# Altium project Carrier_Board.PrjPcb (part 2 of 2)

## Sheet [03] - GSM.SchDoc
size A2
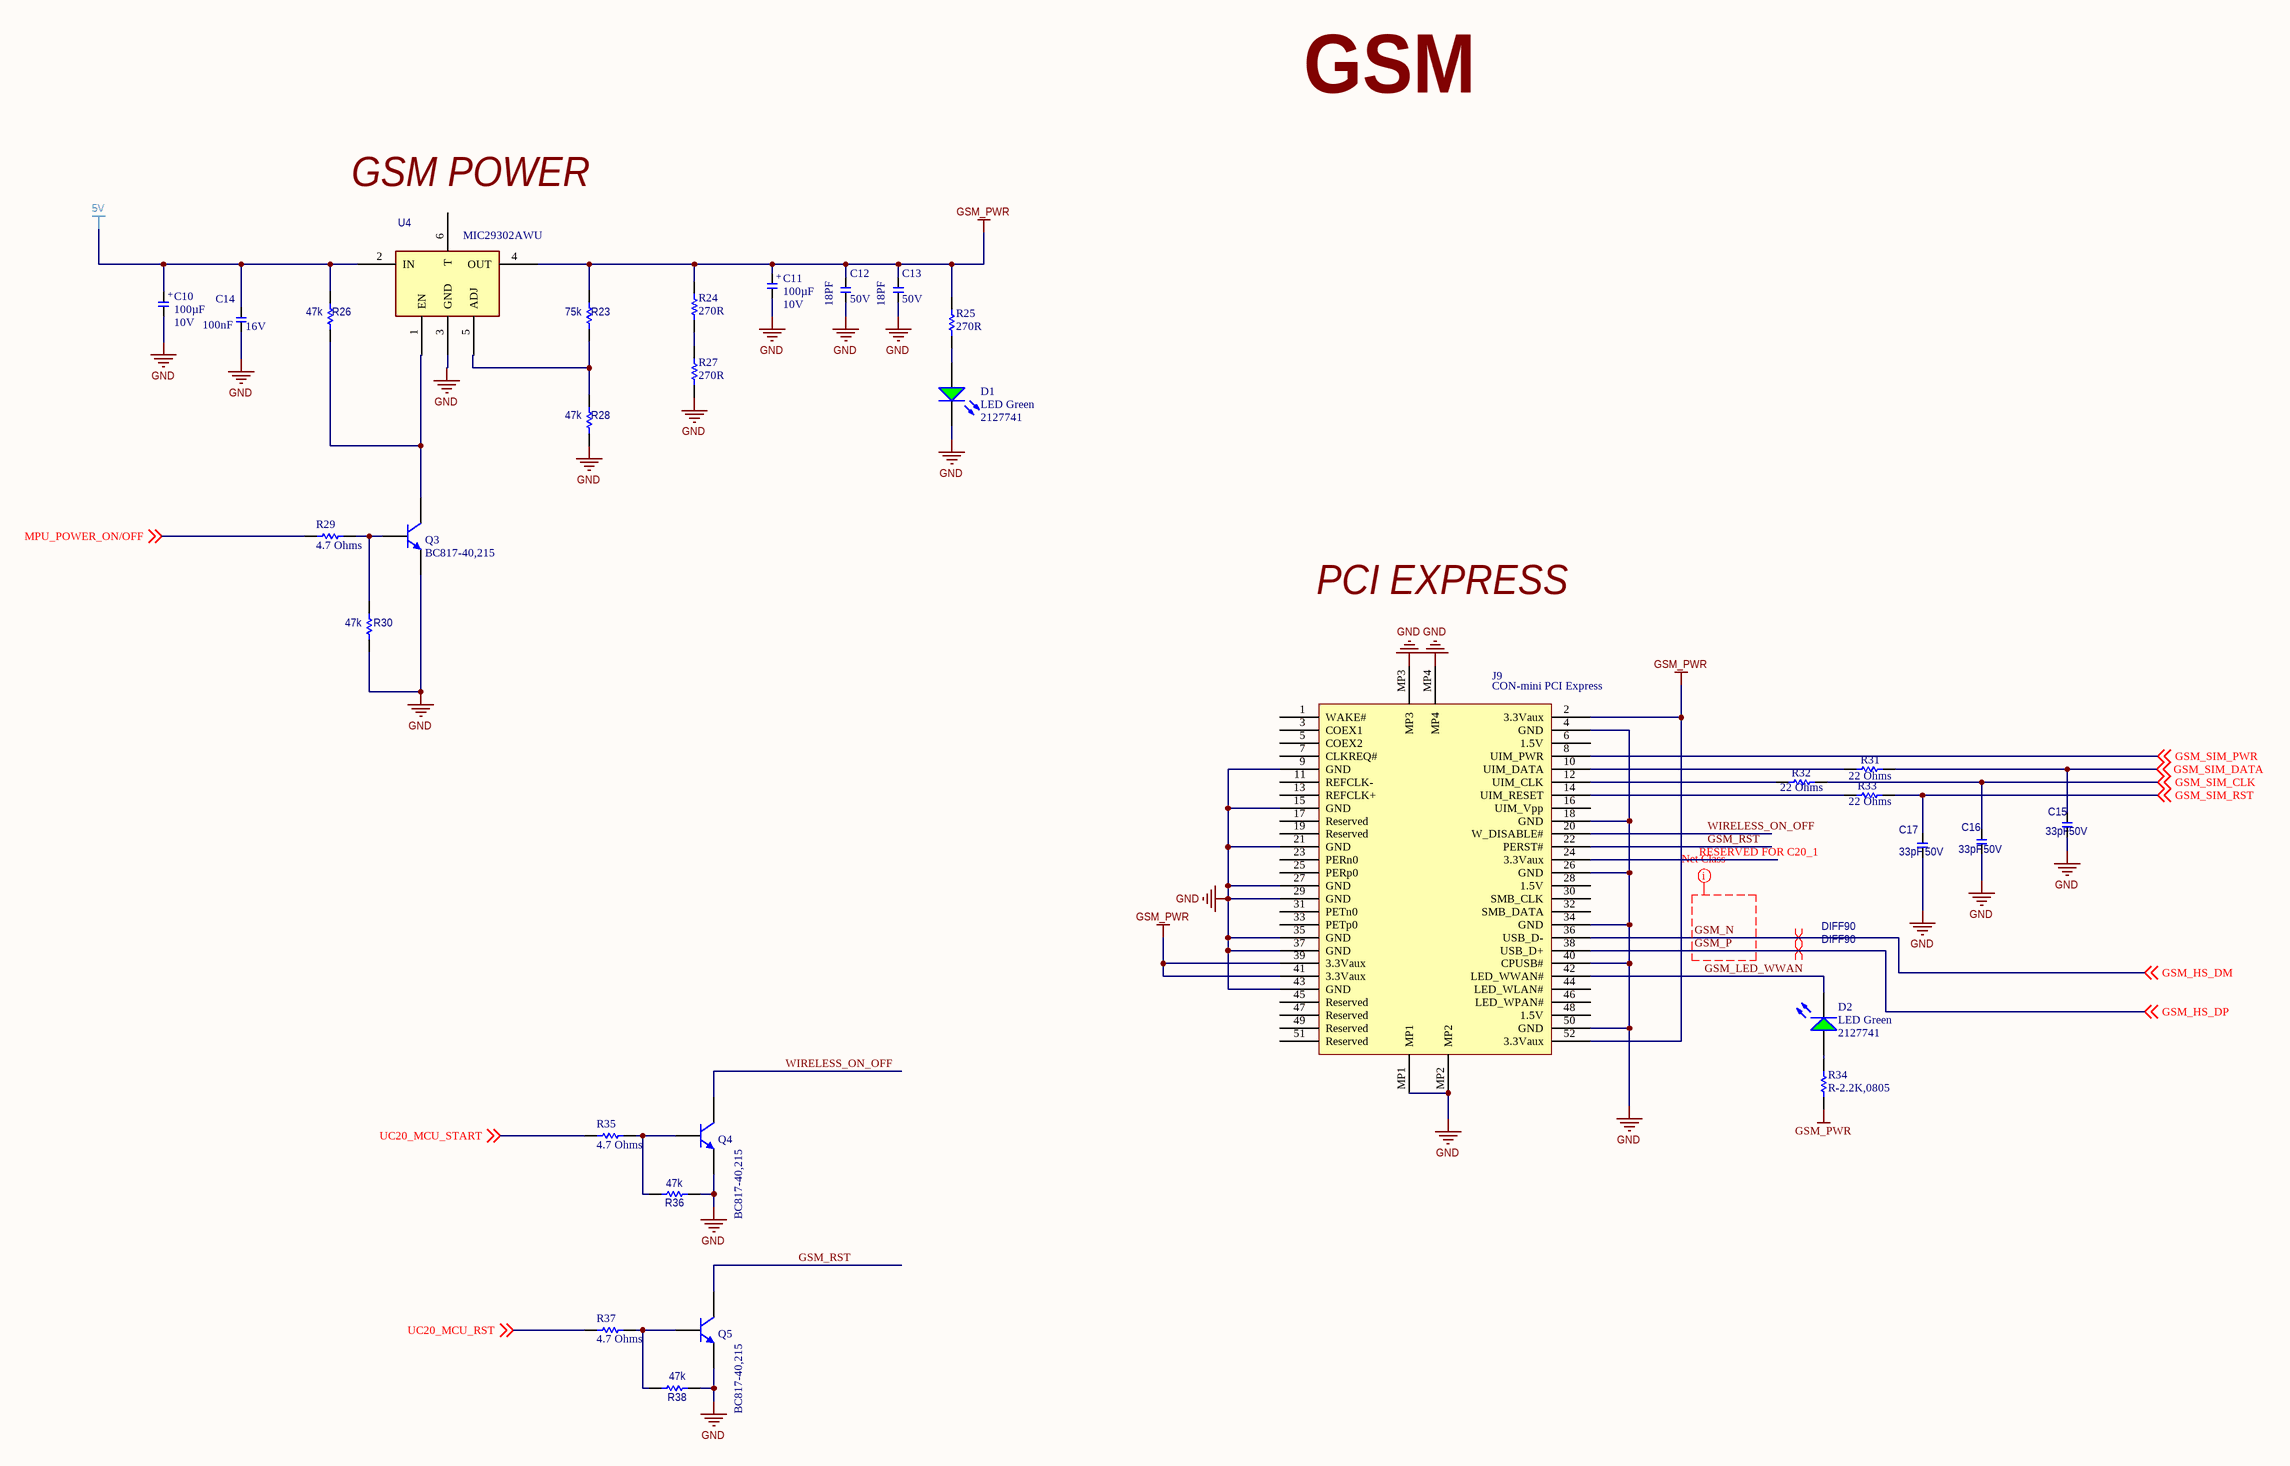
[diagram p3: [03] - GSM.SchDoc]

### Parts
C10  Voltage - Rated: 10V  [Case_C]  (hidden comment: 100µF)
C11  Voltage - Rated: 10V  [Case_C]  (hidden comment: 100µF)
C12  18PF  voltage_rating_dc: 50V  [C0805]
C13  18PF  voltage_rating_dc: 50V  [C0805]
C14  100nF  Voltage - Rated: 16V  [C0805]
C15  Capacitance: 33pF  Voltage - Rated: 50V  [C0805]  (hidden comment: CAP CER 33PF 50V)
C16  Capacitance: 33pF  Voltage - Rated: 50V  [C0805]  (hidden comment: CAP CER 33PF 50V)
C17  Capacitance: 33pF  Voltage - Rated: 50V  [C0805]  (hidden comment: CAP CER 33PF 50V)
D1  LED Green  Supplier Part Number 1: 2127741  [LED_0805]
D2  LED Green  Supplier Part Number 1: 2127741  [LED_0805]
J9  CON-mini PCI Express  [GSM]
Q3  BC817-40,215  [SO-G3/Y1]
Q4  BC817-40,215  [SO-G3/Y1]
Q5  BC817-40,215  [SO-G3/Y1]
R23  Resistance (Ohms): 75k  [R1206]  (hidden comment: RES SMD 75K OHM)
R24  270R  [R0805]
R25  270R  [R0805]
R26  Resistance (Ohms): 47k  [R0805]  (hidden comment: RES SMD 47K OHM)
R27  270R  [R0805]
R28  Resistance (Ohms): 47k  [R0805]  (hidden comment: RES SMD 47K OHM)
R29  4.7 Ohms  [R0805]
R30  Resistance (Ohms): 47k  [R0805]  (hidden comment: RES SMD 47K OHM)
R31  22 Ohms  [R0805]
R32  22 Ohms  [R0805]
R33  22 Ohms  [R0805]
R34  R-2.2K,0805  [R0805]
R35  4.7 Ohms  [R0805]
R36  Resistance (Ohms): 47k  [R0805]  (hidden comment: RES SMD 47K OHM)
R37  4.7 Ohms  [R0805]
R38  Resistance (Ohms): 47k  [R0805]  (hidden comment: RES SMD 47K OHM)
U4  MIC29302AWU  [TO-263-5]

### Nets
5V: C10.1 C14.2 R26.1 U4.2(IN)
GND: C10.2 C11.2 C12.1 C13.1 C14.1 C15.2 C16.2 C17.2 D1.1(K) J9.4(GND) J9.9(GND) J9.15(GND) J9.18(GND) J9.21(GND) J9.26(GND) J9.27(GND) J9.29(GND) J9.34(GND) J9.35(GND) J9.37(GND) J9.40(CPUSB#) J9.43(GND) J9.50(GND) J9.MP1 J9.MP2 J9.MP3 J9.MP4 Q3.2(E) Q4.2(E) Q5.2(E) R27.1 R28.2 R30.1 R36.1 R38.1 U4.3(GND)
GSM_PWR: C11.1 C12.2 C13.2 J9.2(3.3Vaux) J9.39(3.3Vaux) J9.41(3.3Vaux) J9.52(3.3Vaux) R23.2 R24.2 R25.2 R34.1 U4.4(OUT)
GSM_LED_WWAN: D2.1(K) J9.42(LED_WWAN#)
GSM_N: J9.36(USB_D-) ; off-sheet GSM_HS_DM  [also labelled GSM_HS_DM]
GSM_P: J9.38(USB_D+) ; off-sheet GSM_HS_DP  [also labelled GSM_HS_DP]
GSM_RST: J9.22(PERST#) Q5.3(C)
GSM_SIM_CLK: C16.1 R32.2 ; off-sheet GSM_SIM_CLK
GSM_SIM_DATA: C15.1 R31.2 ; off-sheet GSM_SIM_DATA
GSM_SIM_PWR: J9.8(UIM_PWR) ; off-sheet GSM_SIM_PWR
GSM_SIM_RST: C17.1 R33.2 ; off-sheet GSM_SIM_RST
MPU_POWER_ON/OFF: R29.1 ; off-sheet MPU_POWER_ON/OFF
RESERVED FOR C20_1: J9.24(3.3Vaux)
UC20_MCU_RST: R37.2 ; off-sheet UC20_MCU_RST
UC20_MCU_START: R35.2 ; off-sheet UC20_MCU_START
WIRELESS_ON_OFF: J9.20(W_DISABLE#) Q4.3(C)
NetD1_2: D1.2(A) R25.1
NetD2_2: D2.2(A) R34.2
NetJ9_10: J9.10(UIM_DATA) R31.1
NetJ9_12: J9.12(UIM_CLK) R32.1
NetJ9_14: J9.14(UIM_RESET) R33.1
NetQ3_1: Q3.1(B) R29.2 R30.2
NetQ3_3: Q3.3(C) R26.2 U4.1(EN)
NetQ4_1: Q4.1(B) R35.1 R36.2
NetQ5_1: Q5.1(B) R37.1 R38.2
NetR23_1: R23.1 R28.1 U4.5(ADJ)
NetR24_1: R24.1 R27.2

Not connected (* = marked no-connect by the designer): J9 1(WAKE#) 3(COEX1) 5(COEX2) 6(1.5V) 7(CLKREQ#) 11(REFCLK-) 13(REFCLK+) 16(UIM_Vpp) 17(Reserved) 19(Reserved) 23(PERn0) 25(PERp0) 28(1.5V) 30(SMB_CLK) 31(PETn0) 32(SMB_DATA) 33(PETp0) 44(LED_WLAN#) 45(Reserved) 46(LED_WPAN#) 47(Reserved) 48(1.5V) 49(Reserved) 51(Reserved); U4 6(T)

### Layout directives
net class GSM_HS: GSM_N, GSM_P
differential pair; net class DIFF90: GSM_N, GSM_P

### Notes on the sheet
- GSM
- GSM POWER
- PCI EXPRESS
- (in symbol C-10UF,TANTAL C) +

### Library data of the parts
C10 C11 = C-10UF,TANTAL C: CAP TANT 100UF 10V 10% 2413; Manufacturer: Kemet; Manufacturer Part Number: T491C107K010AT; Manufacturer Size Code: C; ESR (Equivalent Series Resistance): 1.2 Ohm; Type: Molded; Lifetime @ Temp.: 2000 Hrs @ 85°C; Supplier 1: Digi-Key; RoHS: RoHS Compliant; Category: Capacitors; Stock 1: 1879; Pricing 1: 1=2.2, 10=1.804, 50=1.584, 100=1.276, 250=1.056 (USD); Packaging: Cut Tape (CT); Tolerance: ±10%; Operating Temperature: -55°C ~ 125°C; Mounting Type: Surface Mount; Package / Case: 2413 (6032 Metric); Size / Dimension: 0.236" L x 0.126" W (6.00mm x 3.20mm); Height - Seated (Max): 0.110" (2.80mm); Lead Spacing: -; Features: General Purpose; ComponentLink1URL: http://www.kemet.com/Lists/ProductCatalog/Attachments/254/KEM_T2005_T491.pdf; ComponentLink1Description: http://www.kemet.com/Lists/ProductCatalog/Attachments/254/KEM_T2005_T491.pdf; Supplier Part Number 1: 399-8338-1-ND; Capacitance: 100µF
C12 C13 = C-18PF,50V,0805: MULTICOMP - MC0805N180J500CT - CAP, MLCC, C0G/NP0, 18PF, 50V,0805, REEL; capacitance_tolerance: ±5%; pin_count: 2; Supplier 1: Octopart; Manufacturer: Multicomp; Manufacturer Part Number: MC0805N180J500CT; Pricing 1: 1=0.11400, 10=0.07300, 50=0.04100, 100=0.03200, 250=0.02600, 500=0.02200, 1000=0.01800 (USD); capacitance: 18PF; ComponentLink1URL: http://datasheet.octopart.com/MC0805N180J500CT-Multicomp-datasheet-16478625.pdf; ComponentLink1Description: http://datasheet.octopart.com/MC0805N180J500CT-Multicomp-datasheet-16478625.pdf; Supplier Part Number 1: Newark - 06R4039; Stock 1: 3187; reach_svhc_compliance: No SVHC; rohs_status: Compliant; dielectric_characteristic: C0G/NP0; Octopart Url: http://octopart.com/mc0805n180j500ct-multicomp-10529169; Seller Landing  Url: https://octopart-clicks.com/click/track?country=TR&ak=8157f166&sig=03c9fd1&sid=2402&ppid=10529169&vpid=17760821&ct=offers; OctopartID: 811748bd0de05ed0; ComponentLink2URL: http://datasheet.octopart.com/MC0805N180J500CT-Multicomp-datasheet-22150886.pdf; ComponentLink2Description: http://datasheet.octopart.com/MC0805N180J500CT-Multicomp-datasheet-22150886.pdf; ComponentLink3URL: http://datasheet.octopart.com/MC0805N180J500CT-Multicomp-datasheet-8445804.pdf; ComponentLink3Description: http://datasheet.octopart.com/MC0805N180J500CT-Multicomp-datasheet-8445804.pdf; ComponentLink4URL: http://datasheet.octopart.com/MC0805N180J500CT-Multicomp-datasheet-34215986.pdf; ComponentLink4Description: http://datasheet.octopart.com/MC0805N180J500CT-Multicomp-datasheet-34215986.pdf; ComponentLink5URL: http://datasheet.octopart.com/MC0805N180J500CT-Multicomp-datasheet-26590290.pdf; ComponentLink5Description: http://datasheet.octopart.com/MC0805N180J500CT-Multicomp-datasheet-26590290.pdf; ComponentLink6URL: http://datasheet.octopart.com/MC0805N180J500CT-Multicomp-datasheet-15500401.pdf; ComponentLink6Description: http://datasheet.octopart.com/MC0805N180J500CT-Multicomp-datasheet-15500401.pdf; ComponentLink7URL: http://datasheet.octopart.com/MC0805N180J500CT-Multicomp-datasheet-10838970.pdf; ComponentLink7Description: http://datasheet.octopart.com/MC0805N180J500CT-Multicomp-datasheet-10838970.pdf
C14 = C-100NF,16V,0805: AVX - 0805YA103JAT2A - CAP, MLCC, C0G/NP0, 10NF, 16V, 0805; Tolerance: ±5%; Temperature Coefficient: C0G, NP0; Supplier 1: Digi-Key; Manufacturer: AVX; Manufacturer Part Number: 0805YA103JAT2A; RoHS: YES; Stock 1: 28062; Pricing 1: 1=0.29, 10=0.204, 25=0.1668, 50=0.1424, 100=0.1221, 250=0.10176, 500=0.09158, 1000=0.07733 (USD); Capacitance: 100nF; Packaging: Cut Tape (CT); ComponentLink1URL: http://www.avx.com/docs/Catalogs/ccog.pdf; ComponentLink1Description: http://www.avx.com/docs/Catalogs/ccog.pdf; Supplier Part Number 1: 478-1334-1-ND; ComponentLink2URL: http://www.farnell.com/datasheets/1825494.pdf; ComponentLink2Description: http://www.farnell.com/datasheets/1825494.pdf; Category: Capacitors; Mounting Type: Surface Mount, MLCC; Operating Temperature: -55°C ~ 125°C; Applications: General Purpose; Ratings: -; Package / Case: 0805 (2012 Metric); Size / Dimension: 0.079" L x 0.049" W (2.01mm x 1.25mm); Height - Seated (Max): -; Thickness (Max): 0.037" (0.94mm); Lead Spacing: -; Features: -; Lead Style: -; ComponentLink3URL: http://datasheets.avx.com/C0GNP0-Dielectric.pdf; ComponentLink3Description: http://datasheets.avx.com/C0GNP0-Dielectric.pdf
C15-C17 = C-33PF,0805,50V: CAP CER 33PF 50V NP0 0805; Manufacturer: Samsung Electro-Mechanics America, Inc.; Manufacturer Part Number: CL21C330JBANNNC; Tolerance: ±5%; Temperature Coefficient: C0G, NP0; Supplier 1: Digi-Key; RoHS: RoHS Compliant; Category: Capacitors; Stock 1: 80106; Pricing 1: 1=0.1, 10=0.02, 25=0.0144, 50=0.0108, 100=0.0088, 250=0.00732, 500=0.00626, 1000=0.00492 (USD); Package / Case: 0805 (2012 Metric); Packaging: Cut Tape (CT); ComponentLink1URL: http://www.samsungsem.com/kr/support/product-search/mlcc/__icsFiles/afieldfile/2016/08/18/S_CL21C330JBANNNC.pdf; ComponentLink1Description: http://www.samsungsem.com/kr/support/product-search/mlcc/__icsFiles/afieldfile/2016/08/18/S_CL21C330JBANNNC.pdf; Supplier Part Number 1: 1276-1105-1-ND; Part Status: Active; Mounting Type: Surface Mount, MLCC; Operating Temperature: -55°C ~ 125°C; Applications: General Purpose; Ratings: -; Size / Dimension: 0.079" L x 0.049" W (2.00mm x 1.25mm); Height - Seated (Max): -; Thickness (Max): 0.030" (0.75mm); Lead Spacing: -; Features: -; Lead Style: -
D1 D2 = LED-Green SMD 20mA 2V 0805: LED Green SMD 20mA 2V 0805; TIIntPartnumber: 1F0008; MfrNum: 598-8170-107F; Mfr: Dialight; PartName: LEDGreen2x1.5; Cost10K: 0.052; Cost100: 0.081; Vendor: Digikey; DescriptiveText: LED Green SMD 20mA 2V 0805; Descriptive_Text: LED Green SMD 20mA 2V 0805; Supplier 1: Farnell
J9 = CON-mini PCI Express: PCI EXSPRESS; Supplier 1: Digi-Key; Supplier Part Number 1: WM3471CT-ND
Q3-Q5 = T-BC817-40 NPN: TRANS NPN 45V 0.5A SOT23; Manufacturer: NXP Semiconductors; Current - Collector (Ic) (Max): 500mA; Vce Saturation (Max) @ Ib, Ic: 700mV @ 50mA, 500mA; Current - Collector Cutoff (Max): 100nA (ICBO); DC Current Gain (hFE) (Min) @ Ic, Vce: 250 @ 100mA, 1V; Power - Max: 250mW; Frequency - Transition: 100MHz; Supplier 1: Digi-Key; Manufacturer Part Number: BC817-40,215; RoHS: RoHS Compliant; Category: Discrete Semiconductor Products; Stock 1: 130982; Pricing 1: 1=0.14, 10=0.127, 100=0.0693, 500=0.04258, 1000=0.02905 (USD); Packaging: Cut Tape (CT); ComponentLink1URL: http://www.nxp.com/documents/data_sheet/BC817_BC817W_BC337.pdf; ComponentLink1Description: http://www.nxp.com/documents/data_sheet/BC817_BC817W_BC337.pdf; Supplier Part Number 1: 568-1631-1-ND; Transistor Type: NPN; Voltage - Collector Emitter Breakdown (Max): 45V; Mounting Type: Surface Mount; Package / Case: TO-236-3, SC-59, SOT-23-3; Supplier Device Package: SOT-23 (TO-236AB)
R23 = R-75k,1206: RES SMD 75K OHM 1% 1/4W 1206; Manufacturer: Vishay Dale; Manufacturer Part Number: CRCW120675K0FKEA; Temperature Coefficient: ±100ppm/°C; Power (Watts): 0.25W, 1/4W; Supplier 1: Digi-Key; RoHS: RoHS Compliant; Category: Resistors; Stock 1: 28544; Pricing 1: 1=0.1, 10=0.054, 25=0.0392, 50=0.03, 100=0.0221, 250=0.01684, 500=0.01346, 1000=0.00991, 2500=0.0086 (USD); Height: 0.024" (0.60mm); Package / Case: 1206 (3216 Metric); Packaging: Cut Tape (CT); Tolerance: ±1%; ComponentLink1URL: http://www.vishay.com/docs/20035/dcrcwe3.pdf; ComponentLink1Description: http://www.vishay.com/docs/20035/dcrcwe3.pdf; Supplier Part Number 1: 541-75.0KFCT-ND; Part Status: Active; Composition: Thick Film; Features: Automotive AEC-Q200; Operating Temperature: -55°C ~ 155°C; Supplier Device Package: 1206; Size / Dimension: 0.126" L x 0.063" W (3.20mm x 1.60mm); Number of Terminations: 2; Failure Rate: -
R24 R25 R27 = R-270R,0805: TE CONNECTIVITY / NEOHM 270R Thin Film; Manufacturer Part Number: CPF0805B270RE1; Product Range: TE CONNECTIVITY - CPF Series; Resistance: 270 Ohms; Power Rating: 100; Resistance Tolerance: ± 0.1%; Resistor Case Style: 0805 [2012 Metric]; Temperature Coefficient: ± 25; Voltage Rating: 200; External Depth: 0.5; External Length / Height: 2; External Width: 1.25; Resistor Mounting: SMD; Supplier 1: Farnell; Manufacturer: TE CONNECTIVITY / NEOHM; RoHS: YES; Stock 1: 755; Pricing 1: 10=0,43, 50=0,34, 100=0,32, 500=0,27, 1000=0,24 (EUR); Resistor Element Material: Thin Film; Packaging: Cut Tape; MSL: -; No. of Pins: 2; Operating Temperature Max: 155; Operating Temperature Min: -55; Operating Temperature Range: -55°C to +155; Series: CPF<!--FANDB--><div class="features-and-benefits-container"></div>; ComponentLink1URL: http://www.tycoelectronics.com/commerce/DocumentDelivery/DDEController?Action=srchrtrv&DocNm=1614884&DocType=Customer+Drawing&DocLang=English; ComponentLink1Description: http://www.tycoelectronics.com/commerce/DocumentDelivery/DDEController?Action=srchrtrv&DocNm=1614884&DocType=Customer+Drawing&DocLang=English; ComponentLink2URL: http://www.tycoelectronics.com/commerce/DocumentDelivery/DDEController?Action=srchrtrv&DocNm=1773200&DocType=Data+Sheet&DocLang=English; ComponentLink2Description: http://www.tycoelectronics.com/commerce/DocumentDelivery/DDEController?Action=srchrtrv&DocNm=1773200&DocType=Data+Sheet&DocLang=English; Supplier Part Number 1: 1697424
R26 R28 R30 R36 R38 = R-47K,0805: RES SMD 47K OHM 1% 1/8W 0805; Manufacturer: Samsung Electro-Mechanics America, Inc.; Manufacturer Part Number: RC2012F473CS; Temperature Coefficient: ±100ppm/°C; Power (Watts): 0.125W, 1/8W; Regulator Topology: Positive Adjustable; Voltage - Output: 1.24 V ~ 15 V; Current - Output: 3A; Voltage - Dropout (Typical): 0.45V @ 3A; Number of Regulators: 1; Voltage - Input: 3 V ~ 16 V; Supplier 1: Digi-Key; RoHS: RoHS Compliant; Category: Resistors; Stock 1: 29088; Pricing 1: 1=0.1, 10=0.022, 25=0.016, 50=0.0124, 100=0.0091, 500=0.00554, 1000=0.00408 (USD); Package / Case: 0805 (2012 Metric); Packaging: Cut Tape (CT); Tolerance: ±1%; ComponentLink1URL: http://media.digikey.com/pdf/Data%20Sheets/Samsung%20PDFs/RC_Series_ds.pdf; ComponentLink1Description: http://media.digikey.com/pdf/Data%20Sheets/Samsung%20PDFs/RC_Series_ds.pdf; Supplier Part Number 1: 1276-5377-1-ND; Part Status: Active; Composition: Thick Film; Features: Moisture Resistant; Operating Temperature: -55°C ~ 155°C; Supplier Device Package: 0805; Size / Dimension: 0.079" L x 0.049" W (2.00mm x 1.25mm); Height: 0.024" (0.60mm); Number of Terminations: 2; Failure Rate: -; Current - Limit (Min): 3A; Mounting Type: Surface Mount; ComponentLink2URL: http://www.microchip.com/mymicrochip/filehandler.aspx?ddocname=en580808; ComponentLink2Description: http://www.microchip.com/mymicrochip/filehandler.aspx?ddocname=en580808
R29 R35 R37 = R-4.7K,0805: BOURNS - CR0805-FX-4701GLF - RESISTOR, 4.7K, 0.125W, 1%; Product Range: BOURNS - CR Series; Power Rating: 125; Resistor Case Style: 0805 [2012 Metric]; Resistor Element Material: Thick Film; Temperature Coefficient: ± 100; Voltage Rating: 150; SVHC: No SVHC (16-Jun-2014); Resistor Mounting: SMD<!--FANDB--><div class="features-and-benefits-container"></div>; Supplier 1: Farnell; Manufacturer: BOURNS; Manufacturer Part Number: CR0805-FX-4701GLF; RoHS: YES; Stock 1: 20050; Pricing 1: 50=0,0312, 250=0,0247, 1000=0,0234, 5000=0,0156, 10000=0,0143 (EUR); Resistance: 4.7 Ohms; Resistance Tolerance: ± 1%; Packaging: Cut Tape; MSL: MSL 1 - Unlimited; ComponentLink1URL: http://www.farnell.com/datasheets/1845293.pdf; ComponentLink1Description: http://www.farnell.com/datasheets/1845293.pdf; Supplier Part Number 1: 2008383
R31-R33 = R-22R,0805: PANASONIC - ERJP06F22R0V - RESISTOR, THICK FILM, 22 OHM, 0.5W, 1%; Product Range: PANASONIC - ERJ Series; Power Rating: 500; Resistor Case Style: 0805 [2012 Metric]; Temperature Coefficient: ± 300; Voltage Rating: 400; SVHC: No SVHC (16-Dec-2013); External Depth: 1.25; External Length / Height: 0.6; External Width: 2; Overload Voltage: 600; Reel Quantity: 5000; Resistor Mounting: SMD; Manufacturer: PANASONIC; Manufacturer Part Number: ERJP06F22R0V; RoHS: YES; Resistance: 22 Ohms; Resistance Tolerance: ± 1%; Resistor Element Material: Thick Film; Packaging: Cut Tape; MSL: -; No. of Pins: 2; Operating Temperature Max: 155; Operating Temperature Min: -55; Operating Temperature Range: -55°C to +155; Series: ERJP<!--FANDB--><div class="features-and-benefits-container"></div>; ComponentLink1URL: http://www.farnell.com/datasheets/1801181.pdf; ComponentLink1Description: http://www.farnell.com/datasheets/1801181.pdf; ComponentLink2URL: http://www.farnell.com/datasheets/1718548.pdf; ComponentLink2Description: http://www.farnell.com/datasheets/1718548.pdf; ComponentLink3URL: http://www.farnell.com/cad/1697897.zip; ComponentLink3Description: http://www.farnell.com/cad/1697897.zip; Supplier 1: Farnell; Stock 1: 4425; Pricing 1: 25=0,139, 100=0,113, 500=0,0897, 1000=0,0676, 5000=0,065 (EUR); Supplier Part Number 1: 1750733
R34 = R-2.2K,0805: PANASONIC - ERJP06F2201V - RESISTOR, THICK FILM, 2.2 KOHM, 0.5W, 1%; Product Range: PANASONIC - ERJ Series; Resistance: 2.2K Ohms; Power Rating: 500; Resistor Case Style: 0805 [2012 Metric]; Temperature Coefficient: ± 100; Voltage Rating: 400; SVHC: No SVHC (16-Dec-2013); External Depth: 1.25; External Length / Height: 0.6; External Width: 2; Overload Voltage: 600; Reel Quantity: 5000; Resistor Mounting: SMD; Supplier 1: Farnell; Manufacturer: PANASONIC; Manufacturer Part Number: ERJP06F2201V; RoHS: YES; Stock 1: 750; Pricing 1: 25=0,127, 100=0,105, 500=0,0858, 1000=0,065, 5000=0,0624 (EUR); Resistance Tolerance: ± 1%; Resistor Element Material: Thick Film; Packaging: Cut Tape; MSL: -; No. of Pins: 2; Operating Temperature Max: 155; Operating Temperature Min: -55; Operating Temperature Range: -55°C to +155; Series: ERJP<!--FANDB--><div class="features-and-benefits-container"></div>; ComponentLink1URL: http://www.farnell.com/datasheets/1801181.pdf; ComponentLink1Description: http://www.farnell.com/datasheets/1801181.pdf; ComponentLink2URL: http://www.farnell.com/datasheets/1718548.pdf; ComponentLink2Description: http://www.farnell.com/datasheets/1718548.pdf; ComponentLink3URL: http://www.farnell.com/cad/1697897.zip; ComponentLink3Description: http://www.farnell.com/cad/1697897.zip; Supplier Part Number 1: 1750759
U4 = IC-MIC29302AWU: IC REG LDO ADJ 3A TO263-5; Manufacturer: Microchip Technology; Regulator Topology: Positive Adjustable; Voltage - Output: 1.24 V ~ 15 V; Voltage - Dropout (Typical): 0.45V @ 3A; Number of Regulators: 1; Voltage - Input: 3 V ~ 16 V; Supplier 1: Digi-Key; Manufacturer Part Number: MIC29302AWU; RoHS: RoHS Compliant; Category: Integrated Circuits (ICs); Stock 1: 430; Pricing 1: 1=1.95, 25=1.63, 100=1.48 (USD); Package / Case: TO-263-6, D²Pak (5 Leads + Tab), TO-263BA; Packaging: Tube; ComponentLink1URL: http://www.microchip.com/mymicrochip/filehandler.aspx?ddocname=en580808; ComponentLink1Description: http://www.microchip.com/mymicrochip/filehandler.aspx?ddocname=en580808; Supplier Part Number 1: 576-4072-ND; Part Status: Active; Current - Output: 3A; Current - Limit (Min): 3A; Operating Temperature: -40°C ~ 125°C; Mounting Type: Surface Mount; Supplier Device Package: TO-263-5

## Sheet [04] - PCI-Modul.SchDoc
size A2
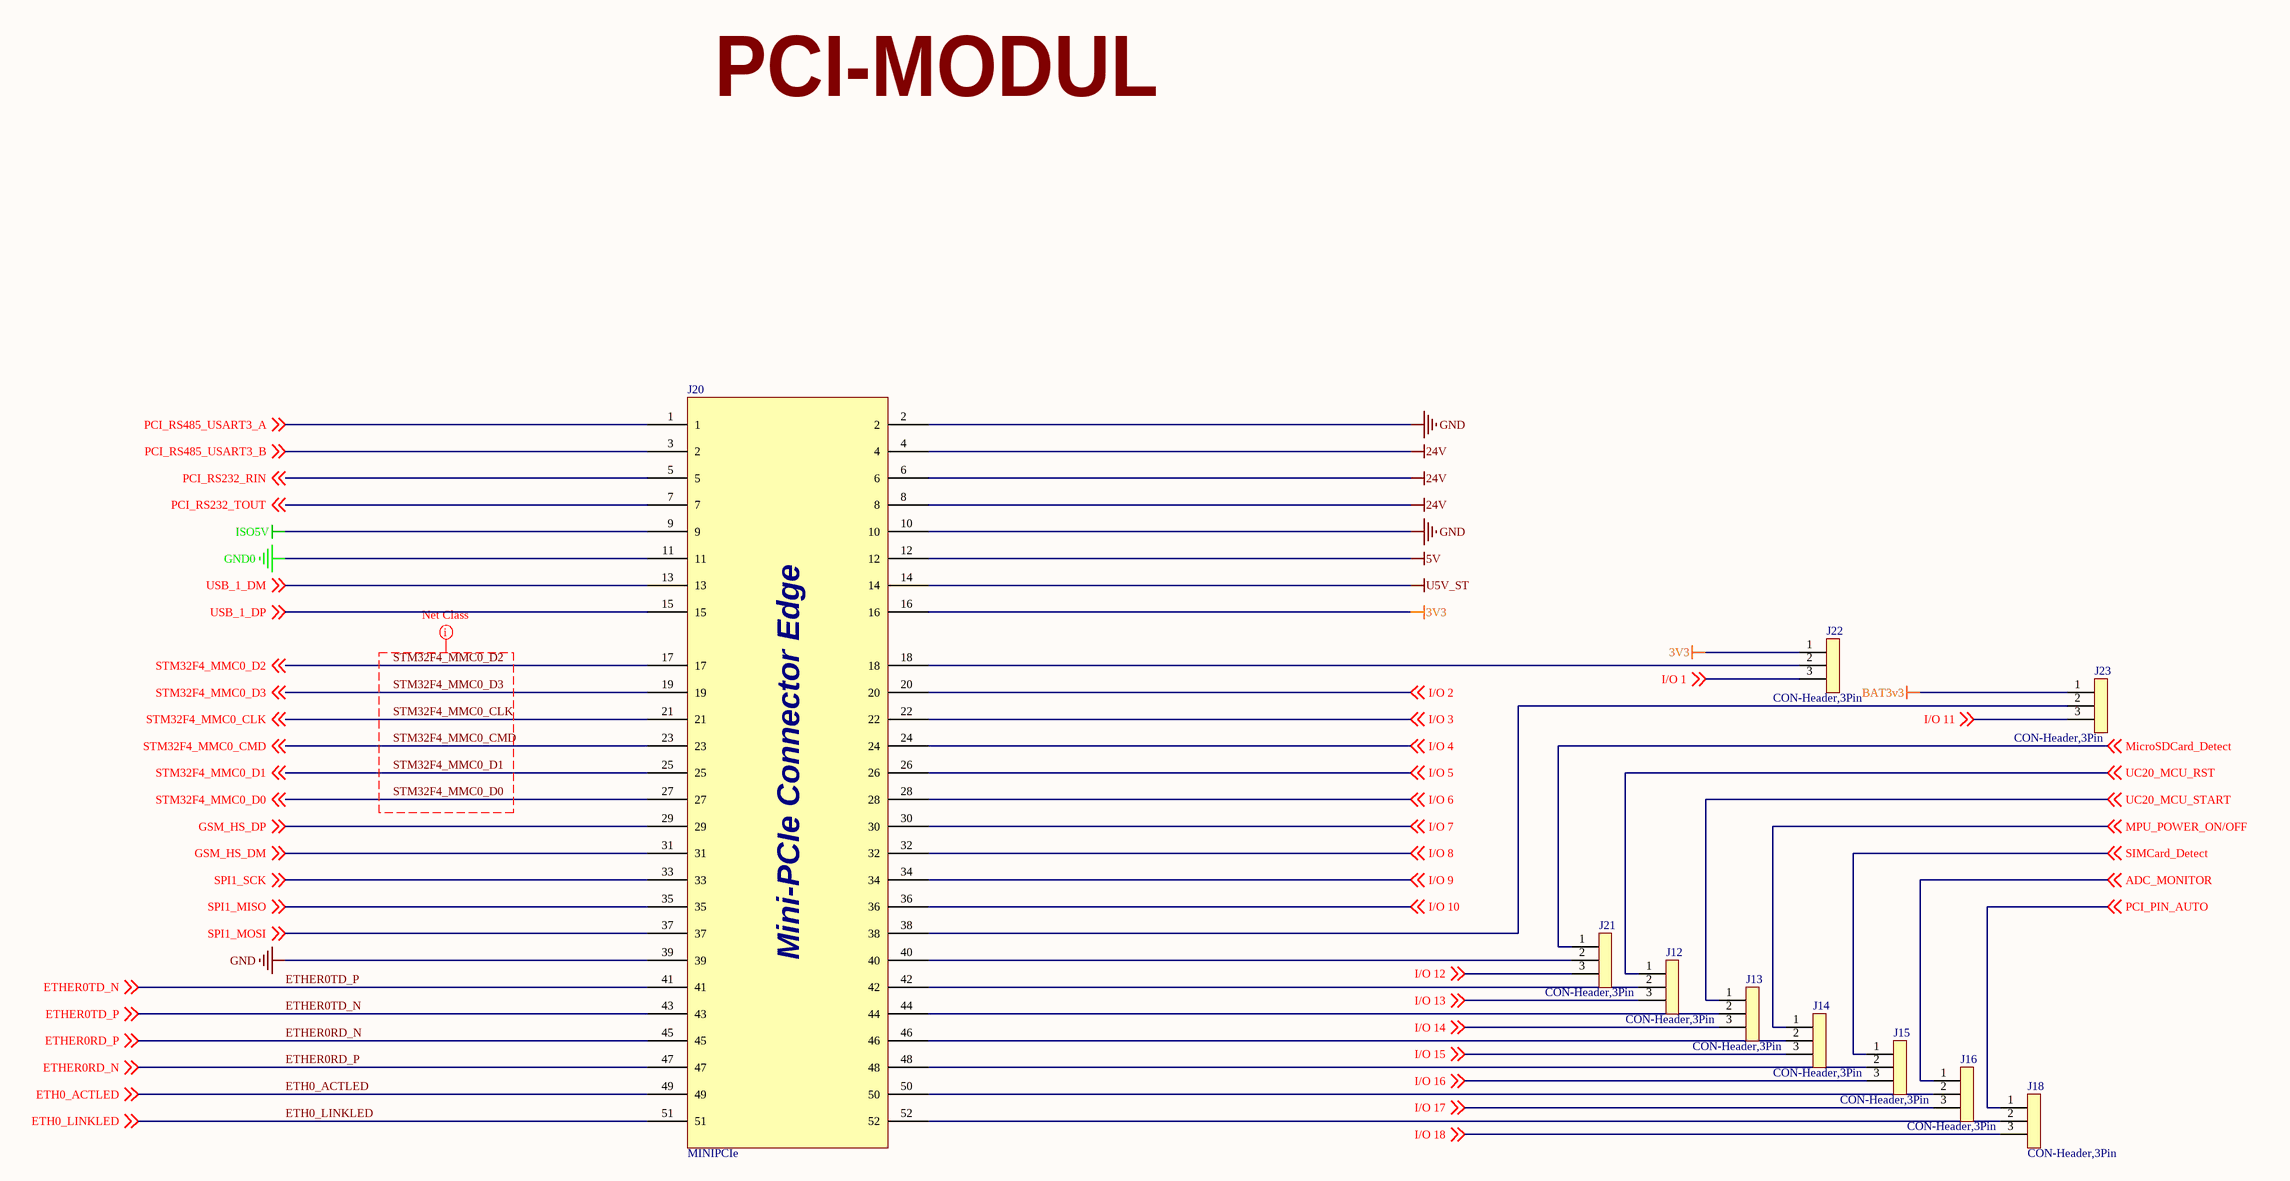
[diagram p4: [04] - PCI-Modul.SchDoc]

### Parts
(Parts that share a designator on the sheet are numbered #1, #2 ... from top to bottom, then left to right.)
J12  CON-Header,3Pin  [SMD HEADER 0805]
J13  CON-Header,3Pin  [SMD HEADER 0805]
J14  CON-Header,3Pin  [SMD HEADER 0805]
J15  CON-Header,3Pin  [SMD HEADER 0805]
J16  CON-Header,3Pin  [SMD HEADER 0805]
J18#2  CON-Header,3Pin  [SMD HEADER 0805]
J20  MINIPCIe  [PCI MODUL]
J21  CON-Header,3Pin  [SMD HEADER 0805]
J22  CON-Header,3Pin  [SMD HEADER 0805]
J23  CON-Header,3Pin  [SMD HEADER 0805]

### Nets
3V3: J20.16 J22.1
5V: J20.12
24V: J20.4 J20.6 J20.8
BAT3v3: J23.1
GND: J20.2 J20.10 J20.39
GND0: J20.11
ISO5V: J20.9
U5V_ST: J20.14
ADC_MONITOR: J16.1 ; off-sheet ADC_MONITOR
ETH0_ACTLED: J20.49 ; off-sheet ETH0_ACTLED
ETH0_LINKLED: J20.51 ; off-sheet ETH0_LINKLED
ETHER0RD_N: J20.45 J20.47 ; off-sheet ETHER0RD_P, off-sheet ETHER0RD_N  [also labelled ETHER0RD_P]
ETHER0TD_N: J20.41 J20.43 ; off-sheet ETHER0TD_N, off-sheet ETHER0TD_P  [also labelled ETHER0TD_P]
GSM_HS_DM: J20.31 ; off-sheet GSM_HS_DM  [project net GSM_N]
GSM_HS_DP: J20.29 ; off-sheet GSM_HS_DP  [project net GSM_P]
I/O 1: J22.3 ; off-sheet I/O 1
I/O 2: J20.20 ; off-sheet I/O 2
I/O 3: J20.22 ; off-sheet I/O 3
I/O 4: J20.24 ; off-sheet I/O 4
I/O 5: J20.26 ; off-sheet I/O 5
I/O 6: J20.28 ; off-sheet I/O 6
I/O 7: J20.30 ; off-sheet I/O 7
I/O 8: J20.32 ; off-sheet I/O 8
I/O 9: J20.34 ; off-sheet I/O 9
I/O 10: J20.36 ; off-sheet I/O 10
I/O 11: J23.3 ; off-sheet I/O 11
I/O 12: J21.3 ; off-sheet I/O 12
I/O 13: J12.3 ; off-sheet I/O 13
I/O 14: J13.3 ; off-sheet I/O 14
I/O 15: J14.3 ; off-sheet I/O 15
I/O 16: J15.3 ; off-sheet I/O 16
I/O 17: J16.3 ; off-sheet I/O 17
I/O 18: J18#2.3 ; off-sheet I/O 18
MicroSDCard_Detect: J21.1 ; off-sheet MicroSDCard_Detect  [project net MMC_CD0]
MPU_POWER_ON/OFF: J14.1 ; off-sheet MPU_POWER_ON/OFF
PCI_PIN_AUTO: J18#2.1 ; off-sheet PCI_PIN_AUTO
PCI_RS232_RIN: J20.5 ; off-sheet PCI_RS232_RIN
PCI_RS232_TOUT: J20.7 ; off-sheet PCI_RS232_TOUT
PCI_RS485_USART3_A: J20.1 ; off-sheet PCI_RS485_USART3_A
PCI_RS485_USART3_B: J20.3(2) ; off-sheet PCI_RS485_USART3_B
SIMCard_Detect: J15.1 ; off-sheet SIMCard_Detect
SPI1_MISO: J20.35 ; off-sheet SPI1_MISO
SPI1_MOSI: J20.37 ; off-sheet SPI1_MOSI
SPI1_SCK: J20.33 ; off-sheet SPI1_SCK
STM32F4_MMC0_CLK: J20.21 ; off-sheet STM32F4_MMC0_CLK
STM32F4_MMC0_CMD: J20.23 ; off-sheet STM32F4_MMC0_CMD
STM32F4_MMC0_D0: J20.27 ; off-sheet STM32F4_MMC0_D0
STM32F4_MMC0_D1: J20.25 ; off-sheet STM32F4_MMC0_D1
STM32F4_MMC0_D2: J20.17 ; off-sheet STM32F4_MMC0_D2
STM32F4_MMC0_D3: J20.19 ; off-sheet STM32F4_MMC0_D3
UC20_MCU_RST: J12.1 ; off-sheet UC20_MCU_RST
UC20_MCU_START: J13.1 ; off-sheet UC20_MCU_START
USB_1_DM: J20.13 ; off-sheet USB_1_DM
USB_1_DP: J20.15 ; off-sheet USB_1_DP
NetJ12_2: J12.2 J20.42
NetJ13_2: J13.2 J20.44
NetJ14_2: J14.2 J20.46
NetJ15_2: J15.2 J20.48
NetJ16_2: J16.2 J20.50
NetJ18#2_2: J18#2.2 J20.52
NetJ20_18: J20.18 J22.2
NetJ20_38: J20.38 J23.2
NetJ20_40: J20.40 J21.2

### Layout directives
net class MMC_SD: STM32F4_MMC0_CLK, STM32F4_MMC0_CMD, STM32F4_MMC0_D0, STM32F4_MMC0_D1, STM32F4_MMC0_D2, STM32F4_MMC0_D3

### Notes on the sheet
- PCI-MODUL
- (in symbol MINIPCIe) Mini-PCIe Connector Edge

## Nets that join several sheets
3V3: [01] - Connectors (22 pins), [02] - Power (6 pins), [04] - PCI-Modul (J20.16 J22.1)
5V: [01] - Connectors (JBOT.2 JBOT.12 JTOP.2 JTOP.12), [02] - Power (12 pins), [03] - GSM (C10.1 C14.2 R26.1 U4.2), [04] - PCI-Modul (J20.12)
24V: [01] - Connectors (JBOT.1 JBOT.11 JTOP.1 JTOP.11), [02] - Power (5 pins), [04] - PCI-Modul (J20.4 J20.6 J20.8)
BAT3v3: [01] - Connectors (BT1.1 BT1.2), [04] - PCI-Modul (J23.1)
GND: [01] - Connectors (40 pins), [02] - Power (10 pins), [03] - GSM (36 pins), [04] - PCI-Modul (J20.2 J20.10 J20.39)
GND0: [01] - Connectors (8 pins), [04] - PCI-Modul (J20.11)
ISO5V: [01] - Connectors (6 pins), [04] - PCI-Modul (J20.9)
U5V_ST: [01] - Connectors (5 pins), [04] - PCI-Modul (J20.14)
ADC_MONITOR: [02] - Power (C25.2 R40.2), [04] - PCI-Modul (J16.1)
ETH0_ACTLED: [01] - Connectors (J8.D6), [04] - PCI-Modul (J20.49)
ETH0_LINKLED: [01] - Connectors (J8.D5), [04] - PCI-Modul (J20.51)
ETHER0RD_N: [01] - Connectors (J8.1 J8.2), [04] - PCI-Modul (J20.45 J20.47)
ETHER0TD_N: [01] - Connectors (J8.5 J8.6), [04] - PCI-Modul (J20.41 J20.43)
GSM_N: [03] - GSM (J9.36), [04] - PCI-Modul (J20.31)
GSM_P: [03] - GSM (J9.38), [04] - PCI-Modul (J20.29)
GSM_SIM_CLK: [01] - Connectors (J6.3), [03] - GSM (C16.1 R32.2)
GSM_SIM_DATA: [01] - Connectors (J6.7), [03] - GSM (C15.1 R31.2)
GSM_SIM_PWR: [01] - Connectors (C5.1 C6.1 J6.1), [03] - GSM (J9.8)
GSM_SIM_RST: [01] - Connectors (J6.2), [03] - GSM (C17.1 R33.2)
I/O 1: [01] - Connectors (J1.1), [04] - PCI-Modul (J22.3)
I/O 2: [01] - Connectors (J1.2), [04] - PCI-Modul (J20.20)
I/O 3: [01] - Connectors (J1.3), [04] - PCI-Modul (J20.22)
I/O 4: [01] - Connectors (J1.4), [04] - PCI-Modul (J20.24)
I/O 5: [01] - Connectors (J1.5), [04] - PCI-Modul (J20.26)
I/O 6: [01] - Connectors (J1.6), [04] - PCI-Modul (J20.28)
I/O 7: [01] - Connectors (J1.7), [04] - PCI-Modul (J20.30)
I/O 8: [01] - Connectors (J1.8), [04] - PCI-Modul (J20.32)
I/O 9: [01] - Connectors (J1.9), [04] - PCI-Modul (J20.34)
I/O 10: [01] - Connectors (J1.10), [04] - PCI-Modul (J20.36)
I/O 11: [01] - Connectors (J5.1), [04] - PCI-Modul (J23.3)
I/O 12: [01] - Connectors (J5.2), [04] - PCI-Modul (J21.3)
I/O 13: [01] - Connectors (J5.3), [04] - PCI-Modul (J12.3)
I/O 14: [01] - Connectors (J5.4), [04] - PCI-Modul (J13.3)
I/O 15: [01] - Connectors (J5.5), [04] - PCI-Modul (J14.3)
I/O 16: [01] - Connectors (J5.6), [04] - PCI-Modul (J15.3)
I/O 17: [01] - Connectors (J5.7), [04] - PCI-Modul (J16.3)
I/O 18: [01] - Connectors (J5.8), [04] - PCI-Modul (J18#2.3)
MMC_CD0: [01] - Connectors (J3.10 R7.1), [04] - PCI-Modul (J21.1)
MPU_POWER_ON/OFF: [03] - GSM (R29.1), [04] - PCI-Modul (J14.1)
PCI_PIN_AUTO: [01] - Connectors (SW1.2 SW2.3 SW2.4), [04] - PCI-Modul (J18#2.1)
PCI_RS232_RIN: [01] - Connectors (J2.2 R13.1), [04] - PCI-Modul (J20.5)
PCI_RS232_TOUT: [01] - Connectors (J2.1 R11.1), [04] - PCI-Modul (J20.7)
PCI_RS485_USART3_A: [01] - Connectors (J4.2 U2.1), [04] - PCI-Modul (J20.1)
PCI_RS485_USART3_B: [01] - Connectors (J4.1 U2.2), [04] - PCI-Modul (J20.3)
SIMCard_Detect: [01] - Connectors (J6.4 J6.22 R8.1), [04] - PCI-Modul (J15.1)
SPI1_MISO: [01] - Connectors (JBOT.9 JBOT.19 JTOP.9 JTOP.19), [04] - PCI-Modul (J20.35)
SPI1_MOSI: [01] - Connectors (JBOT.8 JBOT.18 JTOP.8 JTOP.18), [04] - PCI-Modul (J20.37)
SPI1_SCK: [01] - Connectors (JBOT.10 JBOT.20 JTOP.10 JTOP.20), [04] - PCI-Modul (J20.33)
STM32F4_MMC0_CLK: [01] - Connectors (J3.5), [04] - PCI-Modul (J20.21)
STM32F4_MMC0_CMD: [01] - Connectors (J3.3 R3.1), [04] - PCI-Modul (J20.23)
STM32F4_MMC0_D0: [01] - Connectors (J3.7 R4.1), [04] - PCI-Modul (J20.27)
STM32F4_MMC0_D1: [01] - Connectors (J3.8 R5.1), [04] - PCI-Modul (J20.25)
STM32F4_MMC0_D2: [01] - Connectors (J3.1 R1.1), [04] - PCI-Modul (J20.17)
STM32F4_MMC0_D3: [01] - Connectors (J3.2 R2.1), [04] - PCI-Modul (J20.19)
UC20_MCU_RST: [03] - GSM (R37.2), [04] - PCI-Modul (J12.1)
UC20_MCU_START: [03] - GSM (R35.2), [04] - PCI-Modul (J13.1)
USB_1_DM: [01] - Connectors (J7.2), [04] - PCI-Modul (J20.13)
USB_1_DP: [01] - Connectors (J7.3 R15.1), [04] - PCI-Modul (J20.15)